# Altium schematic sheet Schematic.schdoc
size 199 x 106 mm
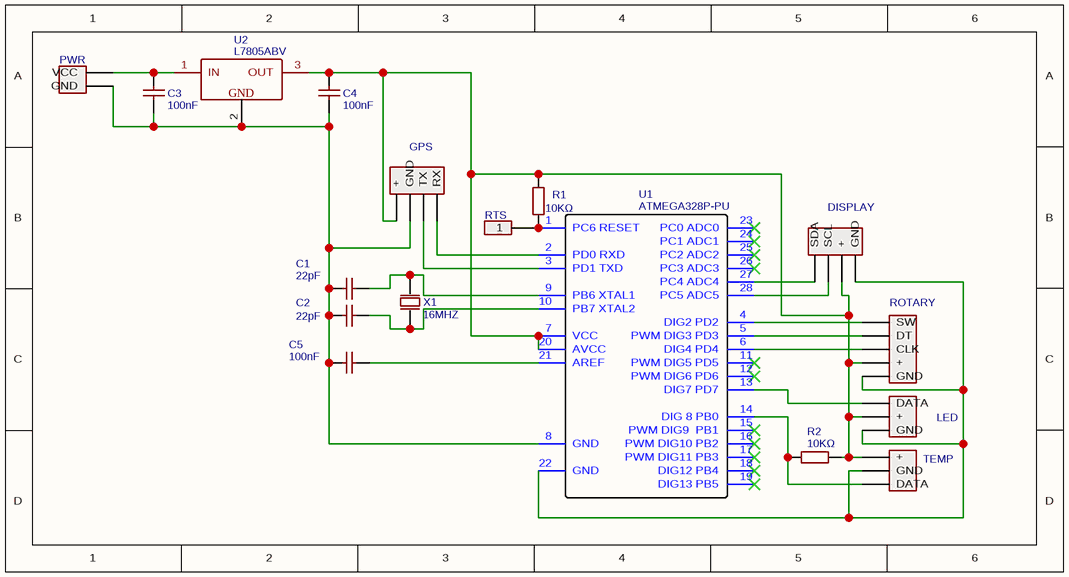
[diagram p0: Schematic.schdoc]

## Parts
C1  22pF  [RAD-0.1]
C2  22pF  [RAD-0.1]
C3  100nF  [RAD-0.1]
C4  100nF  [RAD-0.1]
C5  100nF  [RAD-0.1]
DISPLAY  Header-Male-2.54_1x4  [HDR-4X1/2.54]  (value not drawn)
GPS  Header-Male-2.54_1x4  [HDR-4X1/2.54]  (value not drawn)
LED  Header-Male-2.54_1x3  [HDR-3X1/2.54]  (value not drawn)
PWR  Header-Male-2.54_1x2  [HDR-2X1/2.54]  (value not drawn)
R1  10KΩ  [AXIAL-0.4]
R2  10KΩ  [AXIAL-0.4]
ROTARY  Header-Male-2.54_1x5  [HDR-5X1/2.54]  (value not drawn)
RTS  Header-Male-2.54_1x1  [HDR-1X1/2.54]  (value not drawn)
TEMP  Header-Male-2.54_1x3  [HDR-3X1/2.54]  (value not drawn)
U1  ATMEGA328P-PU  [DIP-28_300MIL]
U2  L7805ABV  [TO-220(TO-220-3)]
X1  16MHZ  [OSC-49S-1]

## Nets
NetC1_1: C1.1 C2.1 C3.1 C4.1 C5.2 GPS.2(GND) PWR.1(GND) U1.8(GND) U2.2(GND)
NetC1_2: C1.2 U1.9(PB6_XTAL1) X1.2(OSC2)
NetC2_2: C2.2 U1.10(PB7_XTAL2) X1.1(OSC1)
NetC3_2: C3.2 PWR.2(VCC) U2.1(IN)
NetC4_2: C4.2 DISPLAY.3(+) GPS.1(+) LED.2(+) R1.1 R2.2 ROTARY.4(+) TEMP.1(+) U1.7(VCC) U1.20(AVCC) U2.3(OUT)
NetC5_1: C5.1 U1.21(AREF)
NetDISPLAY_1: DISPLAY.1(SDA) U1.27(PC4_ADC4)
NetDISPLAY_2: DISPLAY.2(SCL) U1.28(PC5_ADC5)
NetDISPLAY_4: DISPLAY.4(GND) LED.3(GND) ROTARY.5(GND) TEMP.2(GND) U1.22(GND)
NetGPS_3: GPS.3(TX) U1.3(PD1_TXD)
NetGPS_4: GPS.4(RX) U1.2(PD0_RXD)
NetLED_1: LED.1(DATA) U1.13(DIG7_PD7)
NetR1_2: R1.2 RTS.1 U1.1(PC6_RESET)
NetR2_1: R2.1 TEMP.3(DATA) U1.14(DIG_8_PB0)
NetROTARY_1: ROTARY.1(SW) U1.4(DIG2_PD2)
NetROTARY_2: ROTARY.2(DT) U1.5(PWM_DIG3_PD3)
NetROTARY_3: ROTARY.3(CLK) U1.6(DIG4_PD4)

Not connected (* = marked no-connect by the designer): U1 11(PWM_DIG5_PD5)* 12(PWM_DIG6_PD6)* 15(PWM_DIG9__PB1)* 16(PWM_DIG10_PB2)* 17(PWM_DIG11_PB3)* 18(DIG12_PB4)* 19(DIG13_PB5)* 23(PC0_ADC0)* 24(PC1_ADC1)* 25(PC2_ADC2)* 26(PC3_ADC3)*

## Library data of the parts
C1 C2 = (no symbol name): BOM_Manufacturer: ReliaPro; BOM_Manufacturer Part: 22pf/50V 10%; Voltage: 50V; Tolerance: ±10%; Value: 22pF; BOM_Supplier: LCSC; BOM_LCSC: C9316; spicePre: C
C3-C5 = (no symbol name): BOM_Manufacturer: ReliaPro; BOM_Manufacturer Part: CT4-0805Y104M500; Tolerance: 20%; Value: 100nF; BOM_Supplier: LCSC; BOM_LCSC: C46756; spicePre: C
DISPLAY GPS = (no symbol name): BOM_Manufacturer: ReliaPro; BOM_Manufacturer Part: Headers??Pins 1*4P; BOM_Supplier: LCSC; BOM_LCSC: C59481; spicePre: P
LED TEMP = (no symbol name): BOM_Manufacturer: ReliaPro; BOM_Manufacturer Part: Header2.54mm 1*3P; BOM_Supplier: LCSC; BOM_LCSC: C49257; spicePre: P
PWR = (no symbol name): BOM_Manufacturer: ReliaPro; BOM_Manufacturer Part: 2.54mm 1*2P; BOM_Supplier: LCSC; BOM_LCSC: C36717; spicePre: P
R1 R2 = (no symbol name): BOM_Manufacturer: UniOhm; BOM_Manufacturer Part: MFR0W4F1002A50; Power: 1/4W; Tolerance: ±1%; Value: 10KΩ; BOM_Supplier: LCSC; BOM_LCSC: C57436; spicePre: R
ROTARY = (no symbol name): BOM_Manufacturer: ReliaPro; BOM_Manufacturer Part: 2.54mm 1*5P Header; BOM_Supplier: LCSC; BOM_LCSC: C50951; spicePre: P
RTS = (no symbol name): BOM_Manufacturer: ReliaPro; BOM_Manufacturer Part: Header 1*1P; BOM_Supplier: LCSC; BOM_LCSC: C81276; spicePre: P
U1 = (no symbol name): BOM_Manufacturer: ATMEL; catid: 20; sourceId: Oic6oiASL; timeStamp: 1451725987; BOM_Supplier: LCSC; BOM_Manufacturer Part: ATMEGA328P-PU; BOM_LCSC: C33901; spicePre: U
U2 = (no symbol name): BOM_Manufacturer: STMicroelectronics; catid: 20; BOM_Supplier: LCSC; BOM_Manufacturer Part: L7805ABV; BOM_LCSC: C16807; spicePre: U
X1 = (no symbol name): BOM_Manufacturer: YXC; BOM_Manufacturer Part: X49SD16MSD2SC; Value: 16MHZ; BOM_Supplier: LCSC; BOM_LCSC: C16212; spicePre: X